# Altium schematic sheet 12V_Power_Supply.SchDoc
size B
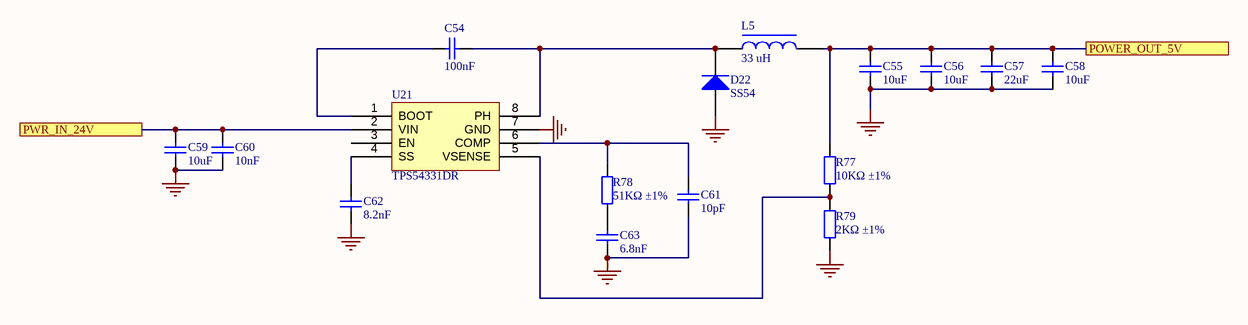
[diagram p0: 12V_Power_Supply.SchDoc]

## Parts
C54  100nF  [0603_C]
C55  10uF  [0603_C]
C56  10uF  [0603_C]
C57  22uF  [0805_C]
C58  10uF  [0603_C]
C59  10uF  [1206_C]
C60  10nF  [0402_C]
C61  10pF  [0402_C]
C62  8.2nF  [0603_C]
C63  6.8nF  [0402_C]
D22  SS54  [SMA(DO-214AC)_S1]
L5  33 uH  [INDPM7366X300N]
R77  10KΩ ±1%  [0402_R]
R78  51KΩ ±1%  [0402_R]
R79  2KΩ ±1%  [0402_R]
U21  TPS54331DR  [SOIC-8_150mil]

## Ports
POWER_OUT_5V, PWR_IN_24V

## Nets
GND: C55.1 C56.1 C57.1 C58.1 C59.1 C60.1 C61.1 C62.1 C63.1 D22.1(A) R79.1 U21.7(GND)
POWER_OUT_5V: C55.2 C56.2 C57.2 C58.2 L5.2 R77.2 ; port POWER_OUT_5V
PWR_IN_24V: C59.2 C60.2 U21.2(VIN) ; port PWR_IN_24V
NetC54_1: C54.1 U21.1(BOOT)
NetC54_2: C54.2 D22.2(K) L5.1 U21.8(PH)
NetC61_2: C61.2 R78.2 U21.6(COMP)
NetC62_2: C62.2 U21.4(SS)
NetC63_2: C63.2 R78.1
NetR77_1: R77.1 R79.2 U21.5(VSENSE)

Not connected (* = marked no-connect by the designer): U21 3(EN)

## Notes on the sheet
- SHEET
- Expatria Technologies
- 1136 Glade Court
- Port Coquitlam, BC V3B 1R5
- PHONE: (778) 238-9336
- PROJECT
- SIZE
- ENGR
- MODIFIED
- DOCUMENT
- REV
- This document contains confidential and proprietary information. No disclosure, reproduction, or transfer of this material in part or in its entirety shall be done without prior written approval.
- EMAIL: INFO@EXPATRIA.CA
- B
- /

## Library data of the parts
C54 = 0603 100nF (104) 10% 50V: Chip capacitors; Manufacturer: YAGEO; PartNumber: CC0603KRX7R9BB104; Tolerance: 10%; Voltage: 50V; ComponentLink1Description: Supplier link; ComponentLink1URL: http://www.szlcsc.com/product/details_15331.html; Package: 0603; Supplier: LC; SuppliersPartNumber: C14663; Capacitance: 100nF
C55 C56 C58 = 0603 10uF (106) 10% 10V: Chip capacitors; Manufacturer: Samsung Electro-Mechanics; PartNumber: CL10A106KP8NNNC; Tolerance: 10%; Voltage: 10V; ComponentLink1Description: Supplier link; ComponentLink1URL: http://www.szlcsc.com/product/details_20411.html; Package: 0603; Supplier: LC; SuppliersPartNumber: C19702; Capacitance: 10uF
C57 = 0805 22uF (226) 20% 25V: Chip capacitors; Manufacturer: Samsung Electro-Mechanics; PartNumber: CL21A226MAQNNNE; Tolerance: 20%; Voltage: 25V; ComponentLink1Description: Supplier link; ComponentLink1URL: http://www.szlcsc.com/product/details_46786.html; Package: 0805; Supplier: LC; SuppliersPartNumber: C45783; Capacitance: 22uF
C59 = 1206 10uF (106) 10% 50V: Chip capacitors; Manufacturer: Samsung Electro-Mechanics; PartNumber: CL31A106KBHNNNE; Tolerance: 10%; Voltage: 50V; ComponentLink1Description: Supplier link; ComponentLink1URL: http://www.szlcsc.com/product/details_14236.html; Package: 1206; Supplier: LC; SuppliersPartNumber: C13585; Capacitance: 10uF
C60 = 0402 10nF (103) 10% 50V: Chip capacitors; Manufacturer: Samsung Electro-Mechanics; PartNumber: CL05B103KB5NNNC; Tolerance: 10%; Voltage: 50V; ComponentLink1Description: Supplier link; ComponentLink1URL: http://www.szlcsc.com/product/details_15869.html; Package: 0402; Supplier: LC; SuppliersPartNumber: C15195; Capacitance: 10nF
C61 = 0402 10pF (100) 5% 50V: Chip capacitors; Manufacturer: Samsung Electro-Mechanics; PartNumber: CL05C100JB5NNNC; Tolerance: 5%; Voltage: 50V; ComponentLink1Description: Supplier link; ComponentLink1URL: http://www.szlcsc.com/product/details_33914.html; Package: 0402; Supplier: LC; SuppliersPartNumber: C32949; Capacitance: 10pF
C62 = 0603 8.2nF (822) 10% 50V: Chip capacitors; Manufacturer: Samsung Electro-Mechanics; PartNumber: CL10B822KB8NNNC; Tolerance: 10%; Voltage: 50V; ComponentLink1Description: Supplier link; ComponentLink1URL: http://www.szlcsc.com/product/details_28670.html; Package: 0603; Supplier: LC; SuppliersPartNumber: C27920; Capacitance: 8.2nF
C63 = 0402 6.8nF (682) 10% 50V: Chip capacitors; Manufacturer: Guangdong Fenghua Advanced Tech; PartNumber: 0402B682K500NT; Tolerance: 10%; Voltage: 50V; ComponentLink1Description: Supplier link; ComponentLink1URL: http://www.szlcsc.com/product/details_1894.html; Package: 0402; Supplier: LC; SuppliersPartNumber: C1542; Capacitance: 6.8nF
D22 = SMA(DO-214AC) SS54: 二极管; ComponentLink1Description: 供应商链接; ComponentLink1URL: http://www.szlcsc.com/product/details_23178.html; Package: SMA(DO-214AC); Supplier: LC; SuppliersPartNumber: C22452
L5 = 1206 10uH 10%: 33uH ±20% 2A 270mΩ SMD,6.6x7.3x3.0mm Power Inductors RoHS; ComponentLink1Description: 供应商链接; ComponentLink1URL: http://www.szlcsc.com/product/details_1403.html; Package: SMD_6.6x7.3x3.0mm; Supplier: JLCPCB; SuppliersPartNumber: C329385
R77 = 0402 10K (1002) 1%: Chip resistor; Manufacturer: Uniroyal Elec; PartNumber: 0402WGF1002TCE; Power: 1/16W; ComponentLink1Description: Supplier link; ComponentLink1URL: http://www.szlcsc.com/product/details_26487.html; Package: 0402; Supplier: LC; SuppliersPartNumber: C25744; Resistance: 10KΩ; Tolerance: 1%
R78 = 0402 51K (5102) 1%: Chip resistor; Manufacturer: Uniroyal Elec; PartNumber: 0402WGF5102TCE; Power: 1/16W; ComponentLink1Description: Supplier link; ComponentLink1URL: http://www.szlcsc.com/product/details_26537.html; Package: 0402; Supplier: LC; SuppliersPartNumber: C25794; Resistance: 51KΩ; Tolerance: 1%
R79 = 0402 2K (2001) 1%: Chip resistor; Manufacturer: Uniroyal Elec; PartNumber: 0402WGF2001TCE; Power: 1/16W; ComponentLink1Description: Supplier link; ComponentLink1URL: http://www.szlcsc.com/product/details_4516.html; Package: 0402; Supplier: LC; SuppliersPartNumber: C4109; Resistance: 2KΩ; Tolerance: 1%
U21 = TPS54331DR_[C9865]: DC-DC芯片; ComponentLink1Description: 供应商链接; ComponentLink1URL: http://www.szlcsc.com/product/details_10397.html; Package: SOIC-8_150mil; Supplier: LC; SuppliersPartNumber: C9865